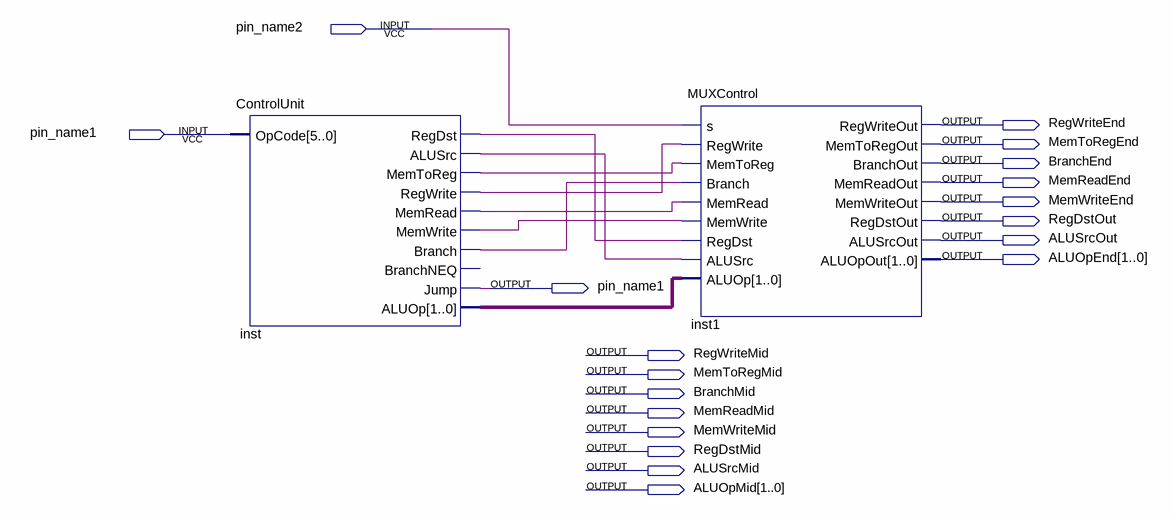
[diagram p0: schematic sheet]
// Quartus schematic test.bdf as structural Verilog: 2 symbols, 19 pins
module test (
  input  pin_name2,
  inout  pin_name1,
  output RegWriteEnd,
  output MemToRegEnd,
  output BranchEnd,
  output MemReadEnd,
  output MemWriteEnd,
  output RegDstOut,
  output ALUSrcOut,
  output [1:0] ALUOpEnd,
  output RegWriteMid,
  output MemToRegMid,
  output BranchMid,
  output MemReadMid,
  output MemWriteMid,
  output RegDstMid,
  output ALUSrcMid,
  output [1:0] ALUOpMid
);

  wire inst_alusrc, inst_branch, inst_memread, inst_memtoreg, inst_memwrite, inst_regdst, inst_regwrite;
  wire [1:0] inst_aluop;

  ControlUnit inst (
    .OpCode({6{pin_name1}}), .RegDst(inst_regdst), .ALUSrc(inst_alusrc), .MemToReg(inst_memtoreg),
    .RegWrite(inst_regwrite), .MemRead(inst_memread), .MemWrite(inst_memwrite), .Branch(inst_branch),
    .Jump(pin_name1), .ALUOp(inst_aluop));  // open: BranchNEQ
  MUXControl inst1 (
    .s(pin_name2), .RegWrite(inst_regwrite), .MemToReg(inst_memtoreg), .Branch(inst_branch),
    .MemRead(inst_memread), .MemWrite(inst_memwrite), .RegDst(inst_regdst), .ALUSrc(inst_alusrc),
    .ALUOp(inst_aluop), .RegWriteOut(RegWriteEnd), .MemToRegOut(MemToRegEnd), .BranchOut(BranchEnd),
    .MemReadOut(MemReadEnd), .MemWriteOut(MemWriteEnd), .RegDstOut(RegDstOut), .ALUSrcOut(ALUSrcOut),
    .ALUOpOut(ALUOpEnd));
endmodule
